# EAGLE design right (EAGLE 7.6.0)
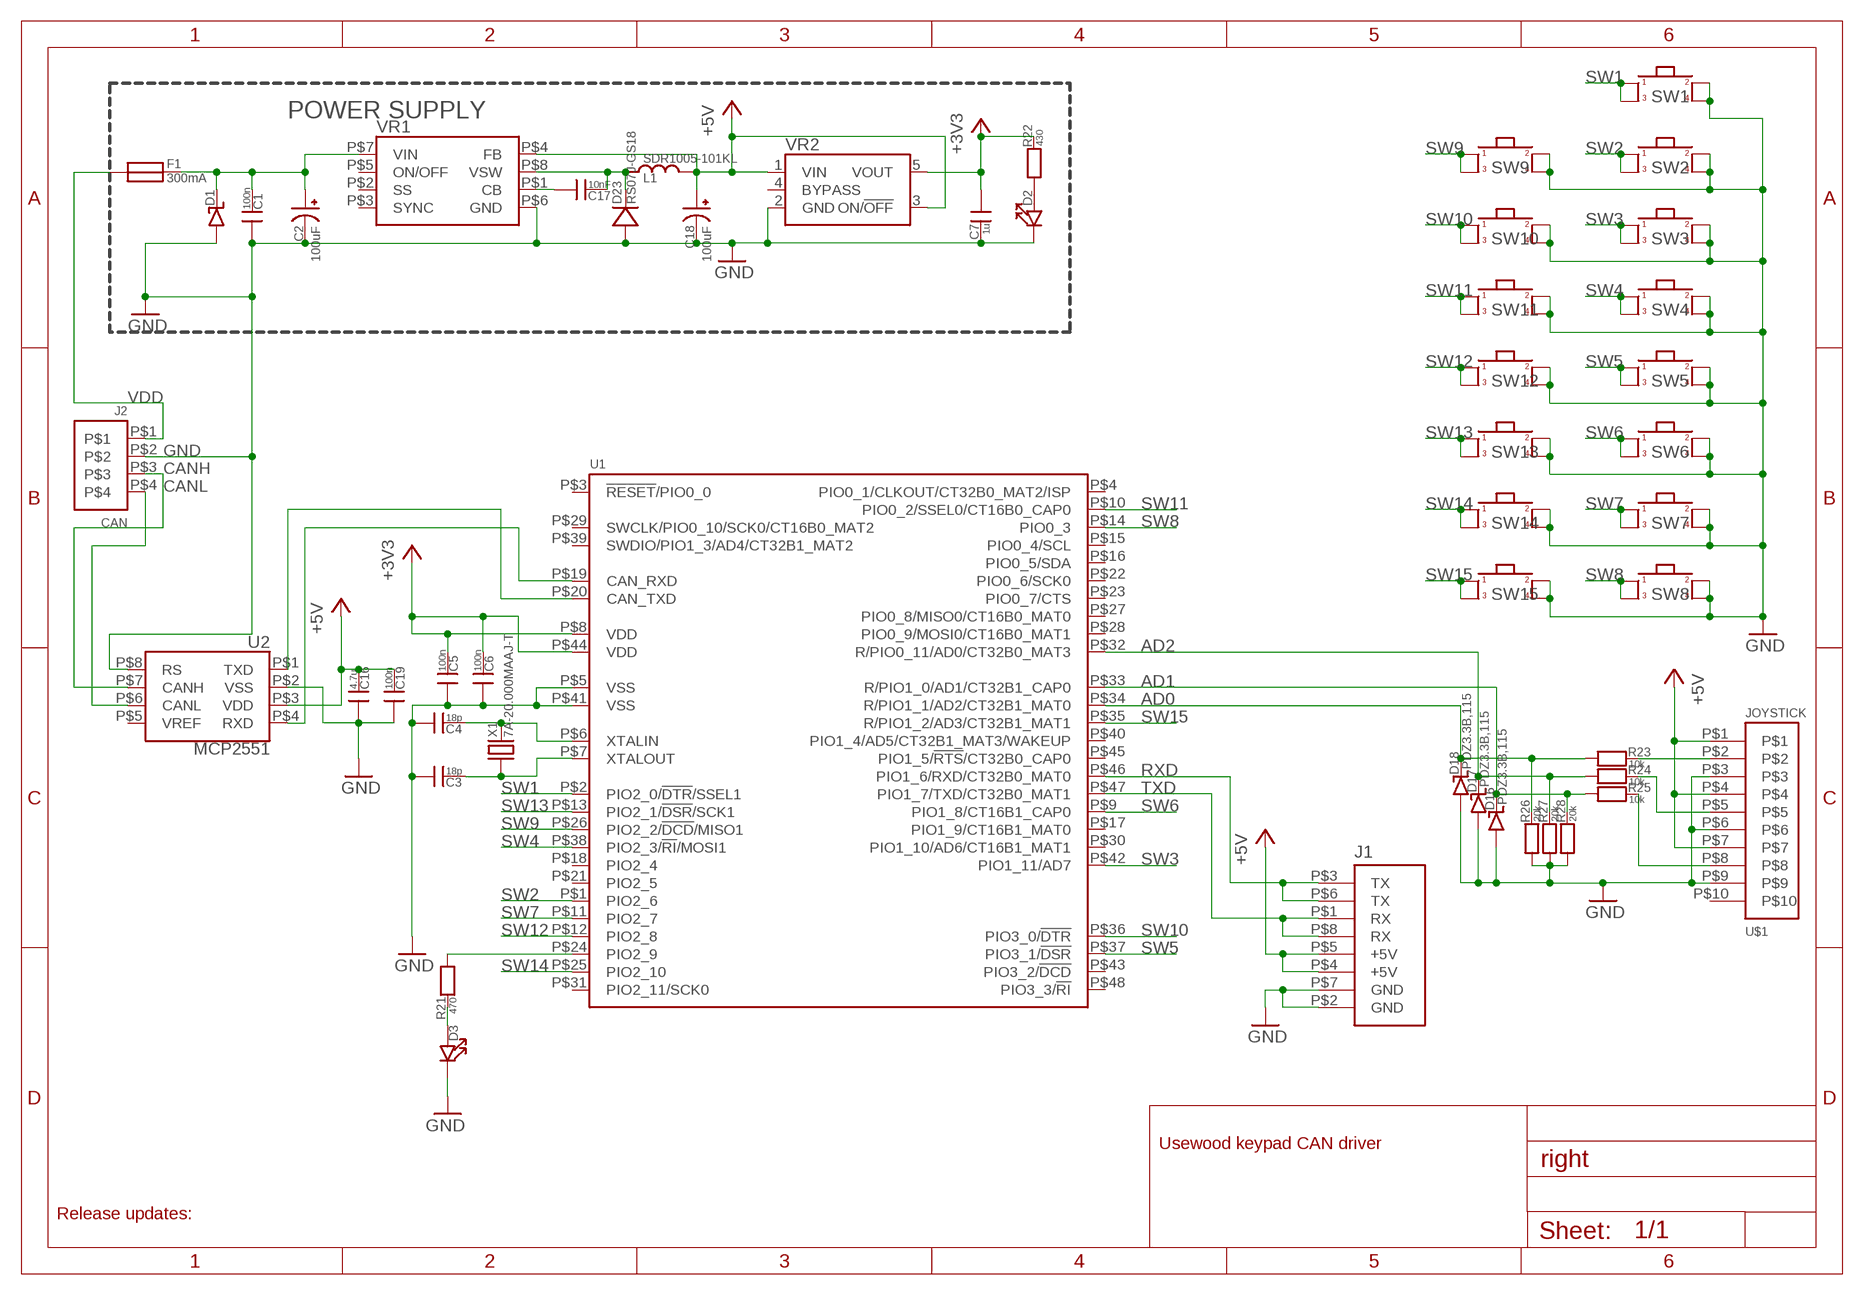
[diagram p0: schematic, sheet 1]

## Parts
C1  100n  CAP_0603  [0603_SILKSCREEN]
C2  100uF  CAP_POLSMD_10X10X10MM  [CAP_POL_SMD_10X10X10MM]
C3  18p  CAP_0603  [0603_SILKSCREEN]
C4  18p  CAP_0603  [0603_SILKSCREEN]
C5  100n  CAP_0603  [0603_SILKSCREEN]
C6  100n  CAP_0603  [0603_SILKSCREEN]
C7  1u  CAP_0603  [0603_SILKSCREEN]
C16  4.7u  CAP_0603  [0603_SILKSCREEN]
C17  10nF  CAP_0603  [0603_SILKSCREEN]
C18  100uF  CAP_POLSMD_10X10X10MM  [CAP_POL_SMD_10X10X10MM]
C19  100n  CAP_0603  [0603_SILKSCREEN]
D1  DIODE_TVS_SMBJ33A-TRDO-214AA  [DO-214AA]
D2  LED_0603  [0603_SILKSCREEN]
D3  LED_0603  [0603_SILKSCREEN]
D16  PDZ3.3B,115  DIODE_ZENERSDO123  [SOD123]
D17  PDZ3.3B,115  DIODE_ZENERSDO123  [SOD123]
D18  PDZ3.3B,115  DIODE_ZENERSDO123  [SOD123]
D23  RS07J-GS18  DIODEDO219AB  [DO219AB]
F1  300mA  FUSE_MC36204_100MA  [FUSE_100MA]
J1  HEADER_USART_2_SMD  [HEADER_4_2_SMD]
J2  CAN  MOLEX_MICRO-FIT_4WAY_SMD  [MOLEX_MICRO_FIT_4WAY_SMD]
L1  SDR1005-101KL  INDUCTORBOURNS_10X13X5MM  [INDUCTOR_BOURNS_10X13X5MM]
R21  470  RES_0603  [0603_SILKSCREEN]
R22  430  RES_0603  [0603_SILKSCREEN]
R23  10k  RES_0603  [0603_SILKSCREEN]
R24  10k  RES_0603  [0603_SILKSCREEN]
R25  10k  RES_0603  [0603_SILKSCREEN]
R26  20k  RES_0603  [0603_SILKSCREEN]
R27  20k  RES_0603  [0603_SILKSCREEN]
R28  20k  RES_0603  [0603_SILKSCREEN]
SW1  SWITCH_KMR231G  [SWITCH_KMR231]
SW2  SWITCH_KMR231G  [SWITCH_KMR231]
SW3  SWITCH_KMR231G  [SWITCH_KMR231]
SW4  SWITCH_KMR231G  [SWITCH_KMR231]
SW5  SWITCH_KMR231G  [SWITCH_KMR231]
SW6  SWITCH_KMR231G  [SWITCH_KMR231]
SW7  SWITCH_KMR231G  [SWITCH_KMR231]
SW8  SWITCH_KMR231G  [SWITCH_KMR231]
SW9  SWITCH_KMR231G  [SWITCH_KMR231]
SW10  SWITCH_KMR231G  [SWITCH_KMR231]
SW11  SWITCH_KMR231G  [SWITCH_KMR231]
SW12  SWITCH_KMR231G  [SWITCH_KMR231]
SW13  SWITCH_KMR231G  [SWITCH_KMR231]
SW14  SWITCH_KMR231G  [SWITCH_KMR231]
SW15  SWITCH_KMR231G  [SWITCH_KMR231]
U1  LPC11C14_QFP48  [QFP48]
U2  MCP2551  MCP2551_SOIC8  [SOIC8]
U$1  JOYSTICK  MOLEX_MICRO-FIT_10WAY_TH  [MOLEX-MICRO-FIT_10WAY]
VR1  LM2671SOIC8  [SOIC8]
VR2  REG_LP2985_SOP5  [SOP5]
X1  7A-20.000MAAJ-T  XTAL_7A-12.000MAAJ-T  [XTAL_SMD_5X3.2]

## Nets
+3V3: C5.1 C6.1 C7.0 R22.1 U1.P$8(VDD) U1.P$44(VDD) VR2.5(VOUT)
+5V: C16.1 C18.+ C19.1 J1.P$4(+5V) J1.P$5(+5V) L1.P$2 U2.P$3(VDD) U$1.P$1 U$1.P$4 U$1.P$7 VR1.P$4(FB) VR2.1(VIN) VR2.3(ON/!OFF)
AD0: D18.P$2(N) R23.0 R26.1 U1.P$34(R/PIO1_1/AD2/CT32B1_MAT0)
AD1: D16.P$2(N) R25.0 R28.1 U1.P$33(R/PIO1_0/AD1/CT32B1_CAP0)
AD2: D17.P$2(N) R24.0 R27.1 U1.P$32(R/PIO0_11/AD0/CT32B0_MAT3)
CANH: J2.P$3 U2.P$7(CANH)
CANL: J2.P$4 U2.P$6(CANL)
GND: C1.0 C2.- C3.0 C4.0 C5.0 C6.0 C7.1 C16.0 C18.- C19.0 D1.P$1(P) D2.1 D3.1 D16.P$1(P) D17.P$1(P) D18.P$1(P) D23.P$1(P) J1.P$2(GND) J1.P$7(GND) J2.P$2 R26.0 R27.0 R28.0 SW1.P$2 SW1.P$4 SW2.P$2 SW2.P$4 SW3.P$2 SW3.P$4 SW4.P$2 SW4.P$4 SW5.P$2 SW5.P$4 SW6.P$2 SW6.P$4 SW7.P$2 SW7.P$4 SW8.P$2 SW8.P$4 SW9.P$2 SW9.P$4 SW10.P$2 SW10.P$4 SW11.P$2 SW11.P$4 SW12.P$2 SW12.P$4 SW13.P$2 SW13.P$4 SW14.P$2 SW14.P$4 SW15.P$2 SW15.P$4 U1.P$5(VSS) U1.P$41(VSS) U2.P$2(VSS) U2.P$8(RS) U$1.P$3 U$1.P$6 U$1.P$9 VR1.P$6(GND) VR2.2(GND)
LED3: D3.0 R21.1
N$1: R21.0 U1.P$24(PIO2_9)
N$3: D2.0 R22.0
N$4: C1.1 C2.+ D1.P$2(N) F1.P$2 VR1.P$7(VIN)
N$6: U1.P$20(CAN_TXD) U2.P$1(TXD)
N$11: C17.1 D23.P$2(N) L1.P$1 VR1.P$8(VSW)
N$20: U1.P$19(CAN_RXD) U2.P$4(RXD)
N$32: C17.0 VR1.P$1(CB)
RXD: J1.P$3(TX) J1.P$6(TX) U1.P$46(PIO1_6/RXD/CT32B0_MAT0)
SW1: SW1.P$1 SW1.P$3 U1.P$2(PIO2_0/!DTR!/SSEL1)
SW2: SW2.P$1 SW2.P$3 U1.P$1(PIO2_6)
SW3: SW3.P$1 SW3.P$3 U1.P$42(PIO1_11/AD7)
SW4: SW4.P$1 SW4.P$3 U1.P$38(PIO2_3/!RI!/MOSI1)
SW5: SW5.P$1 SW5.P$3 U1.P$37(PIO3_1/!DSR)
SW6: SW6.P$1 SW6.P$3 U1.P$9(PIO1_8/CT16B1_CAP0)
SW7: SW7.P$1 SW7.P$3 U1.P$11(PIO2_7)
SW8: SW8.P$1 SW8.P$3 U1.P$14(PIO0_3)
SW9: SW9.P$1 SW9.P$3 U1.P$26(PIO2_2/!DCD!/MISO1)
SW10: SW10.P$1 SW10.P$3 U1.P$36(PIO3_0/!DTR)
SW11: SW11.P$1 SW11.P$3 U1.P$10(PIO0_2/SSEL0/CT16B0_CAP0)
SW12: SW12.P$1 SW12.P$3 U1.P$12(PIO2_8)
SW13: SW13.P$1 SW13.P$3 U1.P$13(PIO2_1/!DSR!/SCK1)
SW14: SW14.P$1 SW14.P$3 U1.P$25(PIO2_10)
SW15: SW15.P$1 SW15.P$3 U1.P$35(R/PIO1_2/AD3/CT32B1_MAT1)
TXD: J1.P$1(RX) J1.P$8(RX) U1.P$47(PIO1_7/TXD/CT32B0_MAT1)
VDD: F1.P$1 J2.P$1
XJOY: R23.1 U$1.P$2
XTALIN: C4.1 U1.P$6(XTALIN) X1.P$2
XTALOUT: C3.1 U1.P$7(XTALOUT) X1.P$1
YJOY: R24.1 U$1.P$5
ZJOY: R25.1 U$1.P$8
Unconnected: U1.P$3(!RESET!/PIO0_0) U1.P$4(PIO0_1/CLKOUT/CT32B0_MAT2/ISP) U1.P$15(PIO0_4/SCL) U1.P$16(PIO0_5/SDA) U1.P$17(PIO1_9/CT16B1_MAT0) U1.P$18(PIO2_4) U1.P$21(PIO2_5) U1.P$22(PIO0_6/SCK0) U1.P$23(PIO0_7/CTS) U1.P$27(PIO0_8/MISO0/CT16B0_MAT0) U1.P$28(PIO0_9/MOSI0/CT16B0_MAT1) U1.P$29(SWCLK/PIO0_10/SCK0/CT16B0_MAT2) U1.P$30(PIO1_10/AD6/CT16B1_MAT1) U1.P$31(PIO2_11/SCK0) U1.P$39(SWDIO/PIO1_3/AD4/CT32B1_MAT2) U1.P$40(PIO1_4/AD5/CT32B1_MAT3/WAKEUP) U1.P$43(PIO3_2/!DCD) U1.P$45(PIO1_5/!RTS!/CT32B0_CAP0) U1.P$48(PIO3_3/!RI) U2.P$5(VREF) U$1.P$10 VR1.P$2(SS) VR1.P$3(SYNC) VR1.P$5(ON/OFF) VR2.4(BYPASS)

## Notes on the sheet
- POWER SUPPLY
- Usewood keypad CAN driver
- Release updates:

## Library data of the parts
C1 C3-C7 C16 C17 C19 = usevolt:CAP; SMD_SIZE: 0603 (1608 metric)
C2 C18 = usevolt:CAP_POL: http://www.farnell.com/datasheets/1909355.pdf PANASONIC ELECTRONIC COMPONENTS EEE1JA101P SMD Aluminium Electrolytic Capacitor, AEC-Q200 S Series, 100 µF, 63 V, Radial Can - SMD, 10 mm Lisää suosikkeihin Huomasitko virheen? Tulosta sivu PANASONIC ELECTRONIC COMPONENTS EEE1JA101P Suurenna napsauttamalla Kuva on vain kuvaavaa tarkoitusta varten. Lue tuotekuvaus tarkempia tietoja varten. PANASONIC ELECTRONIC COMPONENTS Valmistaja PANASONIC ELECTRONIC COMPONENTS Tilauskoodi: 2326162 Valmistajan osanumero EEE1JA101P Technical Data Sheet (106.65KB) EN Tuotteen yleiskatsaus The EEE1JA101P is a surface-mount aluminium Electrolytic Capacitor features high reliability, long life, low impedance and high ripple current of the top-class in AL-E. The S-V series aluminium electrolytic capacitor is applied to an in-vehicle electric equipment and the anti-vibration type (more than Ø8mm) can support. Sheathless (metal case) appearance Polar polarity type Sovellukset Automotive; Industrial Back to top Tuotetiedot, asiakirjat ja muuta Product Range AEC-Q200 S Series Capacitance 100µF Voltage Rating 63V AE Capacitor Case Radial Can - SMD Diameter 10mm ESR - Height 10.2mm Ripple Current AC 60mA Packaging Cut Tape Lifetime @ Temperature 2000 hours @ 85°C Operating Temperature Min -40°C Operating Temperature Max 85°C MSL; DIAMETER: 10mm; FARNELL_ID: 2326162; HEIGHT: 10.2mm; MANUFACTURER_ID: EEE1JA101P
D1 = usevolt:DIODE_TVS_SMBJ33A-TR: http://www.farnell.com/datasheets/1761316.pdf The Transil SMBJ series from STMicroelectronics are transient voltage suppressing diodes. These diodes are used to protect sensitive equipment against electrostatic discharges and electrical over stress. Transil SMBJ series are generally used against surges below 600W (10/1000 µs). Planar technology makes these devices suitable for high end equipment and SMPS where low leakage current and high junction temperature are required. These devices are packaged in SMB footprint in accordance with IPC 7531 standard. High reliability and stability Peak pulse power of 600W at 10/1000µs and 4KW at 8/20µs Standoff voltage range from 5V to 188V Available in unidirectional and bidirectional types Operating temperature range -55°C to 150°C High power capability of 515W Compliant IEC 61000-4-2 level 4, IEC 61000-4-5, UL 94, EIA STD RS-481 and IEC 60286-3 standards Meets MIL STD 883G, MIL-STD-750 standards; FARNELL_ID: 9886257; MANUFACTURER_ID: SMBJ33A-TR
D2 D3 = usevolt:LED; SMD_SIZE: 0603 (1608 metric)
D16-D18 = usevolt:DIODE_ZENER
D23 = usevolt:DIODE
F1 = usevolt:FUSE_MC36204_100MA: Carrying Current Max: 10A Holding Current: 100mA Initial Resistance Max: 15ohm Operating Temperature Max: 85°C Operating Voltage: 60VDC PTC Fuse Case Style: SMD Product Range: MC36 Series SVHC: No SVHC (15-Jun-2015) Tripping Current: 300mA; FARNELL_ID: 1861161; MANUFACTURER_ID: MC36204
J1 = usevolt:HEADER_USART_2
J2 = usevolt:MOLEX_MICRO-FIT_4WAY: http://www.farnell.com/datasheets/2016912.pdf MOLEX 43045-0418 Wire-To-Board Connector, Vertical, Micro-Fit 3.0 43045 Series, Surface Mount, Header, 4, 3 mm ★★★★★ ★★★★★ Lisää suosikkeihin Huomasitko virheen? Tulosta sivu MOLEX 43045-0418 Suurenna napsauttamalla Kuva on vain kuvaavaa tarkoitusta varten. Lue tuotekuvaus tarkempia tietoja varten. MOLEX Valmistaja MOLEX Tilauskoodi: 9961429 Valmistajan osanumero 43045-0418 Pakkaus:: Yksittäispakkaus Technical Data Sheet (30.17KB) EN Inne rodzaje opakowania Kela 200/kela 2426308 Tarkista saatavuus ja hinta Tuotteen yleiskatsaus Fully polarized housings Positive latching Locking tang on terminal Back to top Tuotetiedot, asiakirjat ja muuta Product Range Micro-Fit 3.0 43045 Series No. of Contacts 4 Pitch Spacing 3mm Contact Termination Type Surface Mount Gender Header; FARNELL_ID: 9961429; MANUFACTURER_ID: 43045-0418
L1 = usevolt:INDUCTOR
R21-R28 = usevolt:RES; SMD_SIZE: 0603 (1608 metric)
SW1-SW15 = usevolt:SWITCH_KMR231G: http://www.farnell.com/datasheets/1792623.pdf C & K COMPONENTS KMR231G LFS SWITCH, SMD, 3N, SPST, 0.05A, 32VDC ★★★★★ ★★★★★ Lisää suosikkeihin Huomasitko virheen? Tulosta sivu C & K COMPONENTS KMR231G LFS Suurenna napsauttamalla Kuva on vain kuvaavaa tarkoitusta varten. Lue tuotekuvaus tarkempia tietoja varten. C & K COMPONENTS Valmistaja C & K COMPONENTS Tilauskoodi: 1437636 Valmistajan osanumero KMR231G LFS Technical Data Sheet (150.63KB) EN Tuotteen yleiskatsaus The KMR 2 series from C &K Components are surface mount microminiature tactile switches. Top actuated and 1.9mm height switch Maximum voltage of 32VDC SPST-NO contact configuration Maximum current of 50mA(silver) and 10mA (gold) Long life version Available in 1.2N, 2N, 3N and 4N operating forces Optional ground pin Ultra low current capabilities Momentary action Gull wing terminations; FARNELL_ID: 1437636; MANUFACTURER_ID: KMR231G LFS
U1 = usevolt:LPC11C14: http://www.farnell.com/datasheets/1708214.pdf NXP LPC11C14FBD48/301 32 Bit Microcontroller, Low Power, ARM Cortex-M0, 50 MHz, 32 KB, 8 KB, 48, LQFP Lisää suosikkeihin Huomasitko virheen? Tulosta sivu NXP LPC11C14FBD48/301 Suurenna napsauttamalla Kuva on vain kuvaavaa tarkoitusta varten. Lue tuotekuvaus tarkempia tietoja varten. NXP Valmistaja NXP Tilauskoodi: 1812185 Valmistajan osanumero LPC11C14FBD48/301 Technical Data Sheet (322.12KB) EN Tuotteen yleiskatsaus The LPC11C14FBD48/301 is a 32kB flash 8kB SRAM Cortex-M0 Microcontroller Unit designed for 8/16-bit microcontroller applications, offering performance, low power, simple instruction set and memory addressing together with reduced code size compared to existing 8/16-bit architectures. The peripheral complement of the microcontroller with 32kB of flash memory, 8kB of data memory, one fast-mode Plus I²C-bus interface and one RS-485/EIA-485 UART, two SPI interfaces with SSP features, four general purpose counter/timers, a 10-bit ADC and 40 general purpose I/O pins. ARM Cortex-M0 built-in nested vectored interrupt controller Serial wire debug System tick timer High current output driver on one pin Programmable watchdog timer UART with fractional baud rate generation Integrated PMU to minimize power consumption Sovellukset Metering; Industrial; Sensing & Instrumentation Back to top Tuotetiedot, asiakirjat ja muuta Architecture: ARM Cortex-M0 CPU Speed: 50MHz Embedded Interface Type: CAN, I2C, SPI, UART MCU Case Style: LQFP MSL: - No. of I/O's: 40 No. of Pins: 48 Packaging: Each Program Memory Size: 32KB RAM Memory Size: 8KB SVHC: No SVHC (15-Jun-2015) Supply Voltage Max: 3.6V Supply Voltage Min: 1.8V; FARNELL_ID: 1812185; MANUFACTURER_ID: LPC11C14FBD48/301; MOUSER_ID: 771-LPC11C14FD48301
U2 = usevolt:MCP2551: Microchip High-Speed CAN Transceiver Supports 1 Mb/s operation • Implements ISO-11898 standard physical layer requirements • Suitable for 12V and 24V systems • Externally-controlled slope for reduced RFI emissions • Detection of ground fault (permanent dominant) on TXD input • Power-on reset and voltage brown-out protection • An unpowered node or brown-out event will not disturb the CAN bus • Low current standby operation • Protection against damage due to short-circuit conditions (positive or negative battery voltage) • Protection against high-voltage transients • Automatic thermal shutdown protection • Up to 112 nodes can be connected • High noise immunity due to differential bus implementation • Temperature ranges: - Industrial (I): -40°C to +85°C - Extended (E): -40°C to +125°C http://www.digikey.com/product-detail/en/MCP2551T-E%2FSN/MCP2551T-E%2FSNCT-ND/4307904 http://ww1.microchip.com/downloads/en/DeviceDoc/21667f.pdf http://www.farnell.com/datasheets/657417.pdf http://fi.farnell.com/microchip/mcp2551-i-sn/ic-can-transceiver-hi-speed-smd/dp/9758569
U$1 = usevolt:MOLEX_MICRO-FIT_10WAY: http://www.farnell.com/datasheets/1629759.pdf MOLEX 43045-1006 Wire-To-Board Connector, Right Angle, Micro-Fit 3.0 43045 Series, Surface Mount, Header, 10, 3 mm ★★★★★ ★★★★★ Lisää suosikkeihin Huomasitko virheen? Tulosta sivu MOLEX 43045-1006 Suurenna napsauttamalla Kuva on vain kuvaavaa tarkoitusta varten. Lue tuotekuvaus tarkempia tietoja varten. MOLEX Valmistaja MOLEX Tilauskoodi: 1513882 Valmistajan osanumero 43045-1006 Technical Data Sheet (38.25KB) EN Tuotteen yleiskatsaus Fully polarized housings Positive latching Locking tang on terminal Back to top Tuotetiedot, asiakirjat ja muuta Product Range Micro-Fit 3.0 43045 Series No. of Contacts 10 Pitch Spacing 3mm Contact Termination Type Surface Mount Gender Header No. of Rows 2; FARNELL_ID: 1756713; MANUFACTURER_ID: 43045-1023
VR1 = usevolt:LM2671: TEXAS INSTRUMENTS LM2671MX-5.0/NOPB IC, STEP-DOWN REGULATOR, SOIC-8 http://www.farnell.com/datasheets/1874686.pdf
VR2 = usevolt:REG_LP2985: http://www.farnell.com/datasheets/1965480.pdf TEXAS INSTRUMENTS LP2985-33DBVTE4 Fixed LDO Voltage Regulator, 2.2V to 16V, 280mV Dropout, 3.3Vout, 150mAout, SOT-23-5 Lisää suosikkeihin Huomasitko virheen? Tulosta sivu TEXAS INSTRUMENTS LP2985-33DBVTE4 Suurenna napsauttamalla Kuva on vain kuvaavaa tarkoitusta varten. Lue tuotekuvaus tarkempia tietoja varten. TEXAS INSTRUMENTS Valmistaja TEXAS INSTRUMENTS Tilauskoodi: 1053672 Valmistajan osanumero LP2985-33DBVTE4 Technical Data Sheet (1.24MB) EN Tuotteen yleiskatsaus The LP2985-33DBVTE4 is a 150mA 3.3V low quiescent current low noise fixed-output low-dropout regulator available in voltage of 3.3V, the family has an output tolerance of 1.5% for the non-A version and is capable of delivering 150mA continuous load current. Standard regulator features, such as over-current and over-temperature protection are included. 0.01µA Typical Shutdown current 30µVRMS Low noise with 10nF bypass capacitor Stable with low-ESR capacitors, including ceramic Over-current and thermal protection High peak-current capability ESD protection exceeds JESD 22 Green product and no Sb/Br Sovellukset Power Management; Consumer Electronics; Portable Devices This device has limited built-in ESD protection, leads should be shorted together or the device placed in conductive foam during storage or handling to prevent electrostatic damage to the MOS gates. Back to top Tuotetiedot, asiakirjat ja muuta Dropout Voltage Vdo: 280mV Input Voltage Max: 16V Input Voltage Min: 2.2V LDO Regulator Case Style: SOT-23 MSL: MSL 1 - Unlimited No. of Pins: 5 Operating Temperature Max: 125°C Operating Temperature Min: -40°C Output Current: 150mA Output Voltage Nom.: 3.3V Packaging: Cut Tape; FARNELL_ID: 1053672; INPUT_VOLTAGE_MAX: 16 V; MANUFACTURER_ID: LP2985-33DBVTE4; OUTPUT_CURRENT: 150 mA; OUTPU_VOLTAGE: 3.3 V
X1 = usevolt:XTAL_7A-12.000MAAJ-T: http://www.farnell.com/datasheets/1041607.pdf TXC 7A-12.000MAAJ-T XTAL, 12.000MHZ, 18PF, SMD, 5.0X3.2 ★★★★★ ★★★★★ Lisää suosikkeihin Huomasitko virheen? Tulosta sivu TXC 7A-12.000MAAJ-T Suurenna napsauttamalla Kuva on vain kuvaavaa tarkoitusta varten. Lue tuotekuvaus tarkempia tietoja varten. TXC Valmistaja TXC Tilauskoodi: 1841940RL Valmistajan osanumero 7A-12.000MAAJ-T Technical Data Sheet (503.86KB) EN Uudelleenkelauspalvelut Tuotteen yleiskatsaus The 7A-12.000MAAJ-T is a 5 x 3.2mm SMD Glass Sealed Quartz Crystal. It is designed for automatic mounting and reflow soldering. 2 Pads SMD Glass Sealed Crystal Unit High Reliable Environmental Performance Tight Tolerance and Stability Reasonable Cost and Good Delivery Performance Contains Pb in Sealing Glass Exempted by RoHS Directive Ageing ±3ppm Per Year Max Sovellukset Portable Devices; Computers & Computer Peripherals Back to top Tuotetiedot, asiakirjat ja muuta Product Range 7A Series Frequency Nom 12MHz Frequency Stability + / - 30ppm Frequency Tolerance + / - 30ppm Crystal Case SMD, 5mm x 3.2mm Load Capacitance 18pF Operating Temperature Min -40°C Operating Temperature Max 85°C SVHC; FARNELL_ID: 1841940RL; MANUFACTURER_ID: 7A-12.000MAAJ-T

## Board
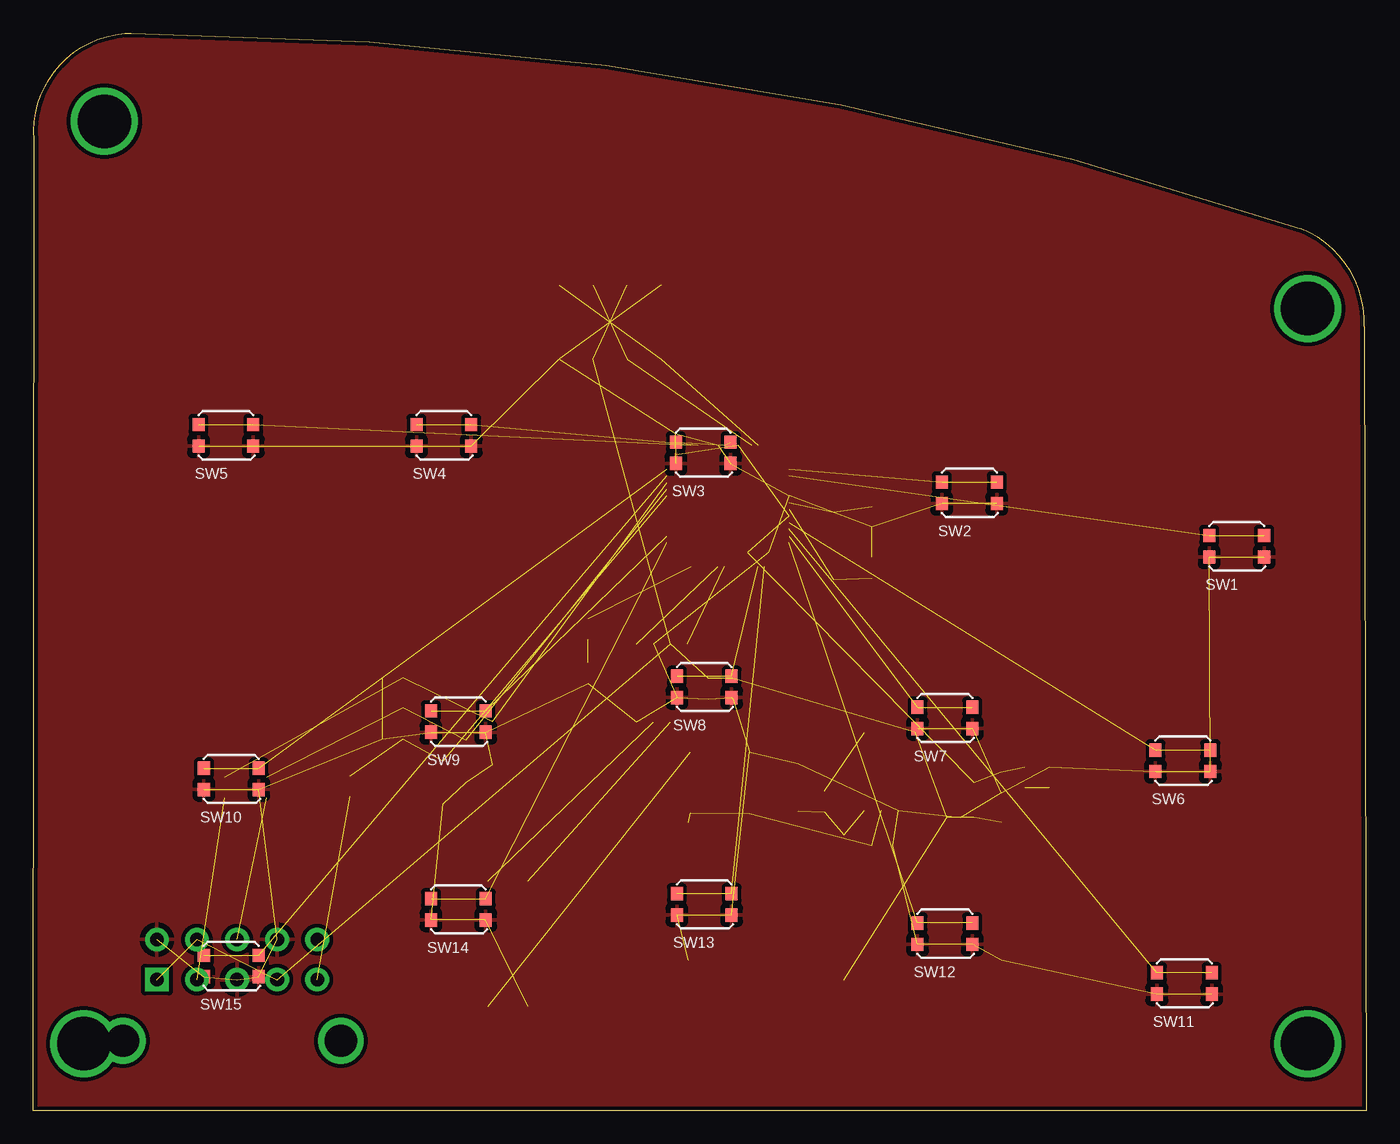
[diagram p1: board, top side]
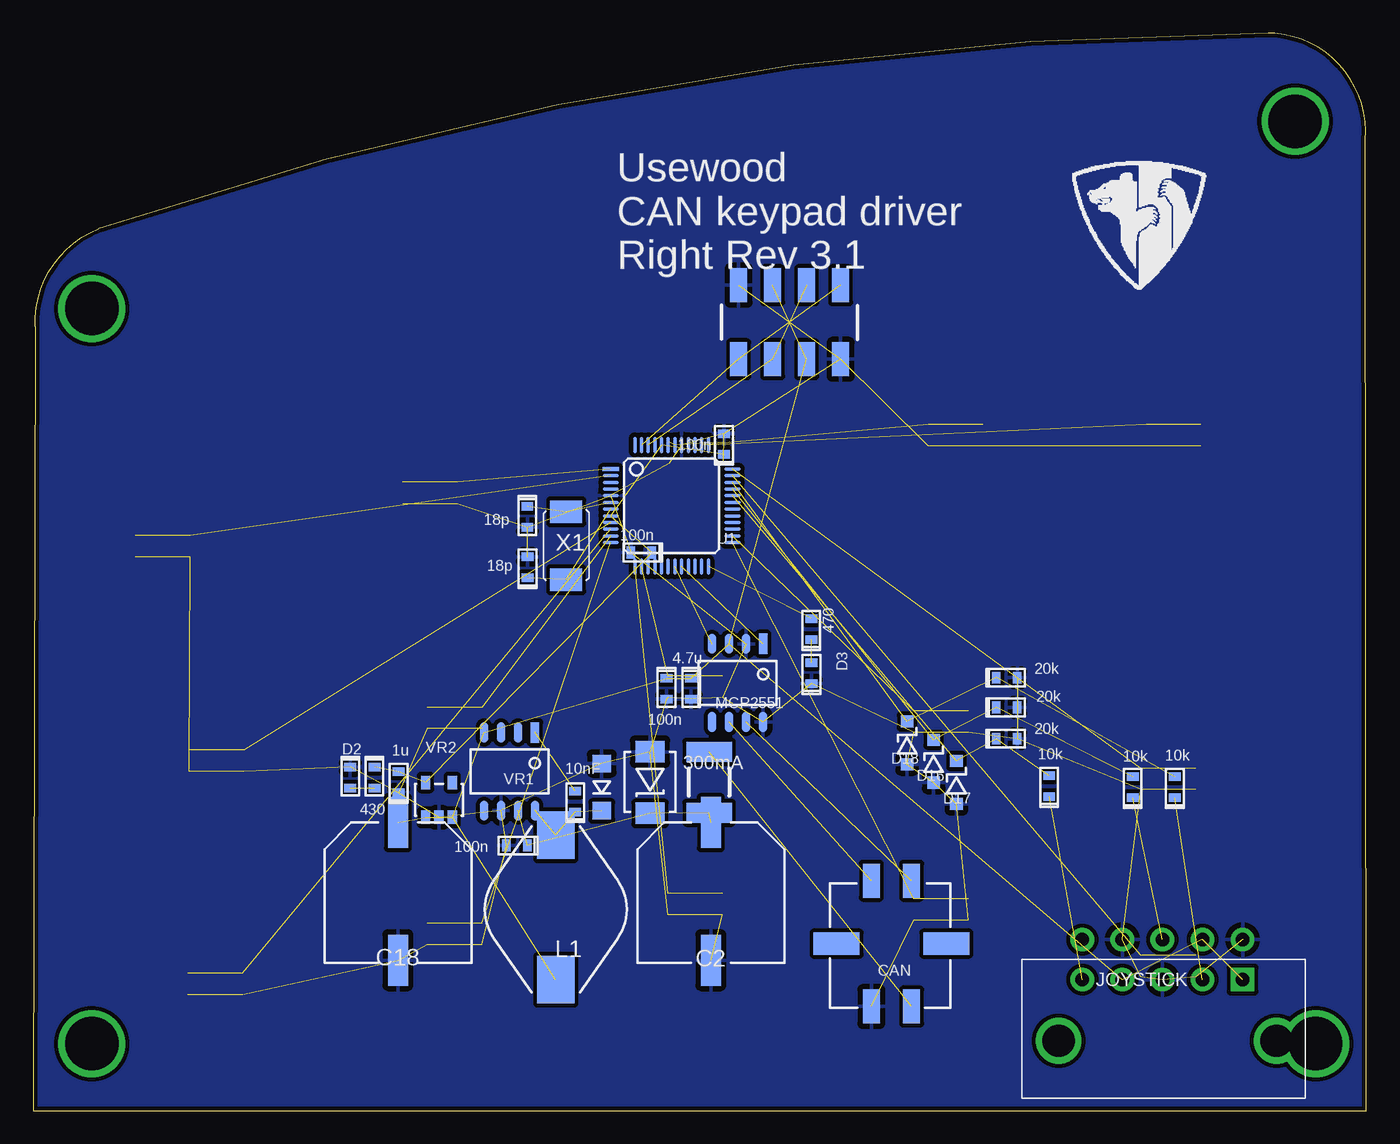
[diagram p2: board, bottom side, seen from below]

Size 99.68 x 80.58 mm. Coordinates in mm from the lower left corner, seen from the top.
Outline: 0,0 0.05,72.6 arc-90 6.81,80.58 7.31,80.58 arc-19 94.8,65.97 arc-71 99.54,58.64 99.68,0 0,0
Copper layers (1*16): Top 0.035mm / dielectric 1.5mm / Bottom 0.035mm
Design rules "SeeedStudio_2layer_DRU_no_angle_20140221 *": minimum track width 6mil, minimum drill 8mil, track to track 6mil, track to pad 6mil, pad to pad 6mil, via to via 6mil, smd to smd 0mil, copper to edge 10mil, drill to drill 10mil, minimum pad ring 10mil, minimum via ring 6mil, stop-mask expansion 2mil, vias tented up to drill 100mil, thermal gap 16mil

### Footprints (pad centres in the part's own frame; a part is rotated, then mirrored left to right if it is on the bottom)
0603_SILKSCREEN = smd 0.635 x 0.889: 0 -0.781,0; 1 0.781,0
CAP_POL_SMD_10X10X10MM = smd 1.5 x 3.81: + 0,-5.15; - 0,5.15
DO-214AA = smd 1.62 x 2.18: P$1 -2.3,0; P$2 2.3,0
SOD123 = smd 0.9 x 0.95: P$1 -1.6,0; P$2 1.6,0
DO219AB = smd 1.3 x 1.4: P$1 -1.768,0; P$2 1.768,0
FUSE_100MA = smd 1.5 x 3.41: P$1 -2.286,0; P$2 2.286,0
HEADER_4_2_SMD = smd 2.54 x 1.27: P$1 -2.769,3.81; P$2 2.769,3.81; P$3 -2.769,1.27; P$4 2.769,1.27; P$5 -2.769,-1.27; P$6 2.769,-1.27; P$7 -2.769,-3.81; P$8 2.769,-3.81
MOLEX_MICRO_FIT_4WAY_SMD = smd 1.27 x 2.54: P$1 1.55,-4.65; P$2 -1.45,-4.65; P$3 1.55,4.75; P$4 -1.45,4.75 | smd 3.43 x 1.65: P$5 4.15,0.05; P$6 -4.05,0.05
INDUCTOR_BOURNS_10X13X5MM = smd 3.556 x 2.8: P$1 -5.404,0; P$2 5.404,0
SWITCH_KMR231 = smd 0.9 x 1: P$1 -2.057,0.813; P$2 -2.057,-0.787; P$3 2.043,0.813; P$4 2.043,-0.787
QFP48 = smd 1.246 x 0.28: P$1 -4.548,2.75; P$2 -4.548,2.25; P$3 -4.548,1.75; P$4 -4.548,1.25; P$5 -4.548,0.75; P$6 -4.548,0.25; P$7 -4.548,-0.25; P$8 -4.548,-0.75; P$9 -4.548,-1.25; P$10 -4.548,-1.75; P$11 -4.548,-2.25; P$12 -4.548,-2.75; P$25 4.548,-2.75; P$26 4.548,-2.25; P$27 4.548,-1.75; P$28 4.548,-1.25; P$29 4.548,-0.75; P$30 4.548,-0.25; P$31 4.548,0.25; P$32 4.548,0.75; P$33 4.548,1.25; P$34 4.548,1.75; P$35 4.548,2.25; P$36 4.548,2.75 | smd 0.28 x 1.246: P$13 -2.75,-4.548; P$14 -2.25,-4.548; P$15 -1.75,-4.548; P$16 -1.25,-4.548; P$17 -0.75,-4.548; P$18 -0.25,-4.548; P$19 0.25,-4.548; P$20 0.75,-4.548; P$21 1.25,-4.548; P$22 1.75,-4.548; P$23 2.25,-4.548; P$24 2.75,-4.548; P$37 2.75,4.548; P$38 2.25,4.548; P$39 1.75,4.548; P$40 1.25,4.548; P$41 0.75,4.548; P$42 0.25,4.548; P$43 -0.25,4.548; P$44 -0.75,4.548; P$45 -1.25,4.548; P$46 -1.75,4.548; P$47 -2.25,4.548; P$48 -2.75,4.548
SOIC8 = smd 1.524 x 0.635: P$1 -2.921,1.905; P$2 -2.921,0.635; P$3 -2.921,-0.635; P$4 -2.921,-1.905; P$5 2.921,-1.905; P$6 2.921,-0.635; P$7 2.921,0.635; P$8 2.921,1.905
MOLEX-MICRO-FIT_10WAY = drill 1.016 pad 1.778 square: P$1 0,-0.508 | drill 1.016 pad 1.778: P$2 -2.997,-0.508; P$3 -5.994,-0.508; P$4 -8.992,-0.508; P$5 -11.989,-0.508; P$6 0,2.489; P$7 -2.997,2.489; P$8 -5.994,2.489; P$9 -8.992,2.489; P$10 -11.989,2.489 | drill 2.41: P$11 2.54,-5.08; P$12 -13.76,-5.08
SOP5 = smd 0.7 x 1: 1 -1,-1.3; 2 0,-1.3; 3 1,-1.3; 4 1,1.3; 5 -1,1.3
XTAL_SMD_5X3.2 = smd 1.7 x 2.4: P$1 -2.54,0; P$2 2.54,0

### Placement (x,y rotation side)
C1  63.52,19.83 0 bottom
C2  49.01,16.4 180 bottom
C3  62.73,40.63 270 bottom
C4  62.74,44.42 90 bottom
C5  54.21,41.74 0 bottom
C6  48.03,49.86 270 bottom
C7  72.36,24.56 270 bottom
C16  50.49,31.56 90 bottom
C17  59.16,23.12 270 bottom
C18  72.41,16.4 180 bottom
C19  52.33,31.56 90 bottom
D1  53.56,24.54 270 bottom
D2  75.98,24.91 90 bottom
D3  41.49,32.73 270 bottom
D16  32.35,26.13 90 bottom
D17  30.65,24.54 90 bottom
D18  34.33,27.51 90 bottom
D23  57.17,24.19 270 bottom
F1  49.15,24.56 270 bottom
J1  43.12,58.97 270 bottom
J2  35.55,12.44 0 bottom
L1  60.61,15.2 270 bottom
R21  41.5,36.02 270 bottom
R22  74.18,24.91 90 bottom
R23  14.3,24.19 270 bottom
R24  23.71,24.27 270 bottom
R25  17.45,24.19 270 bottom
R26  26.87,32.38 180 bottom
R27  26.87,27.82 180 bottom
R28  26.87,30.16 180 bottom
SW1  90.01,42.2 0 top
SW2  70.01,46.2 0 top
SW3  50.11,49.2 0 top
SW4  30.71,50.5 0 top
SW5  14.41,50.5 0 top
SW6  85.99,26.16 0 top
SW7  68.19,29.36 0 top
SW8  50.19,31.68 0 top
SW9  31.79,29.08 0 top
SW10  14.81,24.8 0 top
SW11  86.09,9.5 0 top
SW12  68.19,13.22 0 top
SW13  50.19,15.42 0 top
SW14  31.79,15.04 0 top
SW15  14.81,10.8 0 top
U1  51.95,45.24 0 bottom
U2  47.01,32 270 bottom
U$1  9.24,10.3 0 bottom
VR1  64.08,25.36 270 bottom
VR2  69.35,23.24 0 bottom
X1  59.83,42.25 90 bottom

### Tracks (layer width: path | path; a pad name or v marks a point on that pad's centre or on a via)
+3V3  (6 unrouted)
  pour Bottom (no thermals): 53.51,41.3 53.51,42 53.86,42 53.86,41.72 54.77,40.81 55.19,40.81
+5V  (12 unrouted)
AD0  (3 unrouted)
AD1  (3 unrouted)
AD2  (3 unrouted)
CANH  (1 unrouted)
CANL  (1 unrouted)
GND  (61 unrouted)
  pour Top (isolate 0.3, rank 6): 0,0 0,72.58 arc-48 2.76,78.82 arc-42 7.03,80.5 arc-20 95.02,65.87 arc-21 96.7,64.89 arc-53 99.57,58.03 99.57,0
  pour Bottom (isolate 0.3, rank 6): 0,0 0,72.58 arc-48 2.76,78.82 arc-42 7.03,80.5 arc-20 95.02,65.87 arc-21 96.7,64.89 arc-53 99.57,58.03 99.57,0
LED3  (1 unrouted)
N$1  (1 unrouted)
N$3  (1 unrouted)
N$4  (4 unrouted)
N$6  (1 unrouted)
N$7  (via drill 4)
  other vias: 3.76,5
N$8  (via drill 4)
  other vias: 95.31,5
N$9  (via drill 4)
  other vias: 95.31,60
N$10  (via drill 4)
  other vias: 5.31,74
N$11  (3 unrouted)
N$20  (1 unrouted)
N$32  (1 unrouted)
RXD  (2 unrouted)
SW1  (2 unrouted)
SW2  (2 unrouted)
SW3  (2 unrouted)
SW4  (2 unrouted)
SW5  (2 unrouted)
SW6  (2 unrouted)
SW7  (2 unrouted)
SW8  (2 unrouted)
SW9  (2 unrouted)
SW10  (2 unrouted)
SW11  (2 unrouted)
SW12  (2 unrouted)
SW13  (2 unrouted)
SW14  (2 unrouted)
SW15  (2 unrouted)
TXD  (2 unrouted)
VDD  (1 unrouted)
XJOY  (1 unrouted)
XTALIN  (2 unrouted)
XTALOUT  (2 unrouted)
YJOY  (1 unrouted)
ZJOY  (1 unrouted)

### Text on the board
bPlace: Usewood / CAN keypad driver / Right Rev 3.1